# EAGLE board PX4FMUlite_V5 (EAGLE 6.5.0)
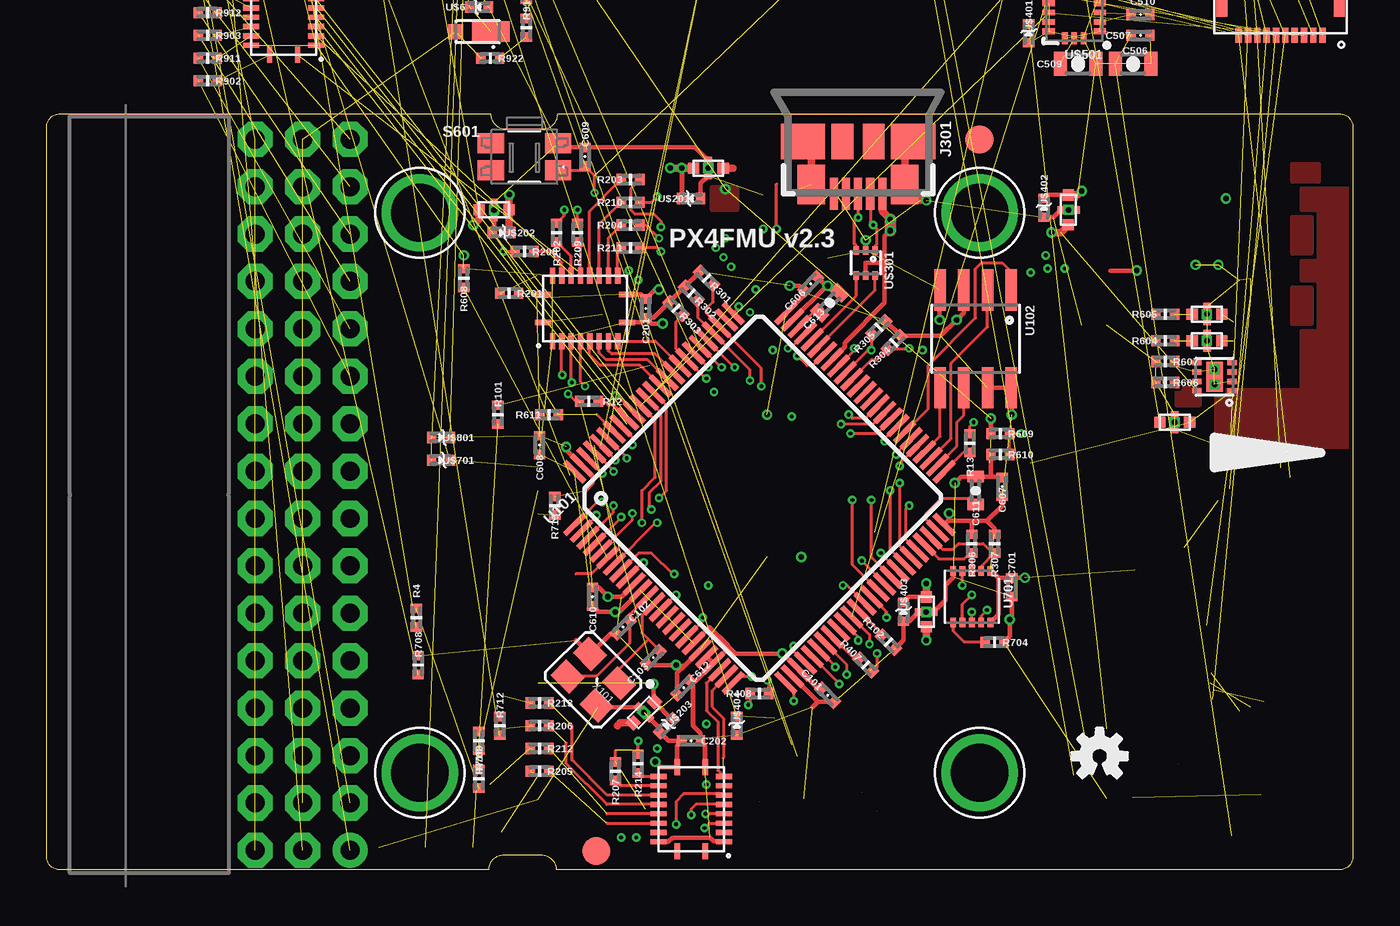
[diagram p12: board, top side]
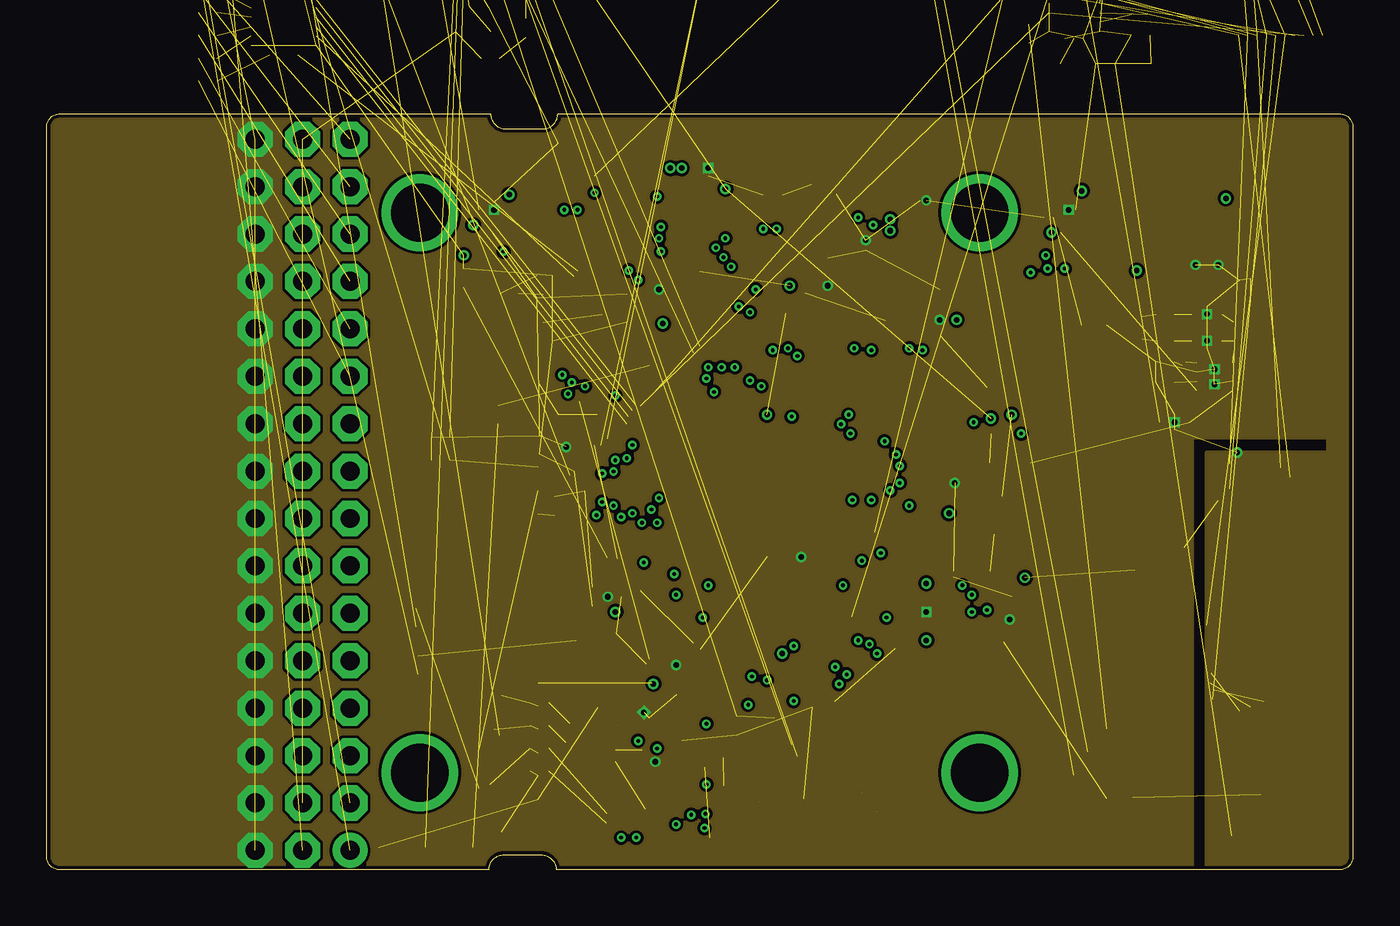
[diagram p13: board, inner layer Ground]
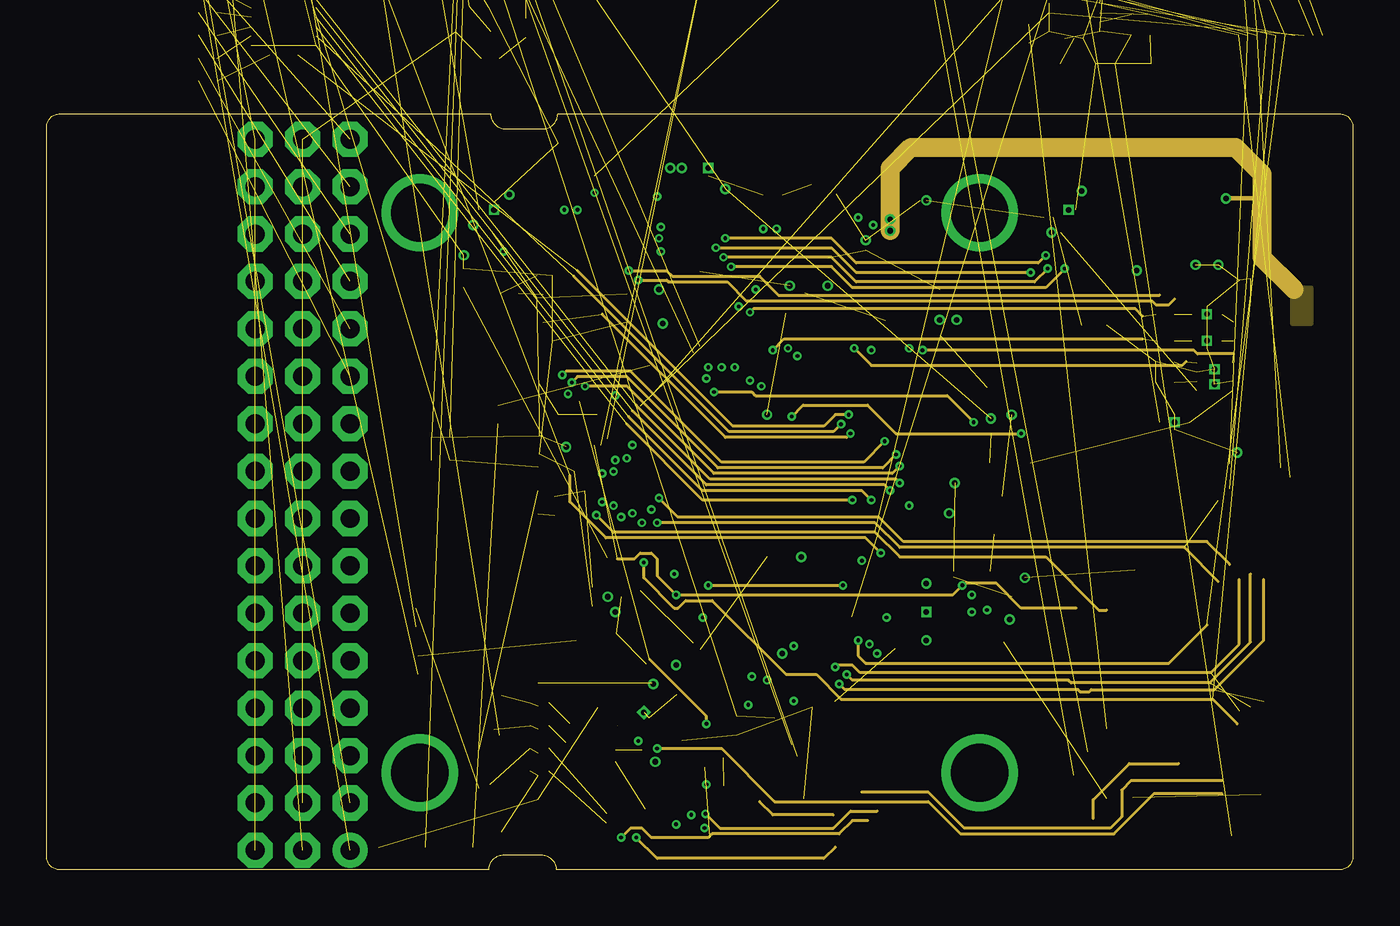
[diagram p14: board, inner layer Horizontal]
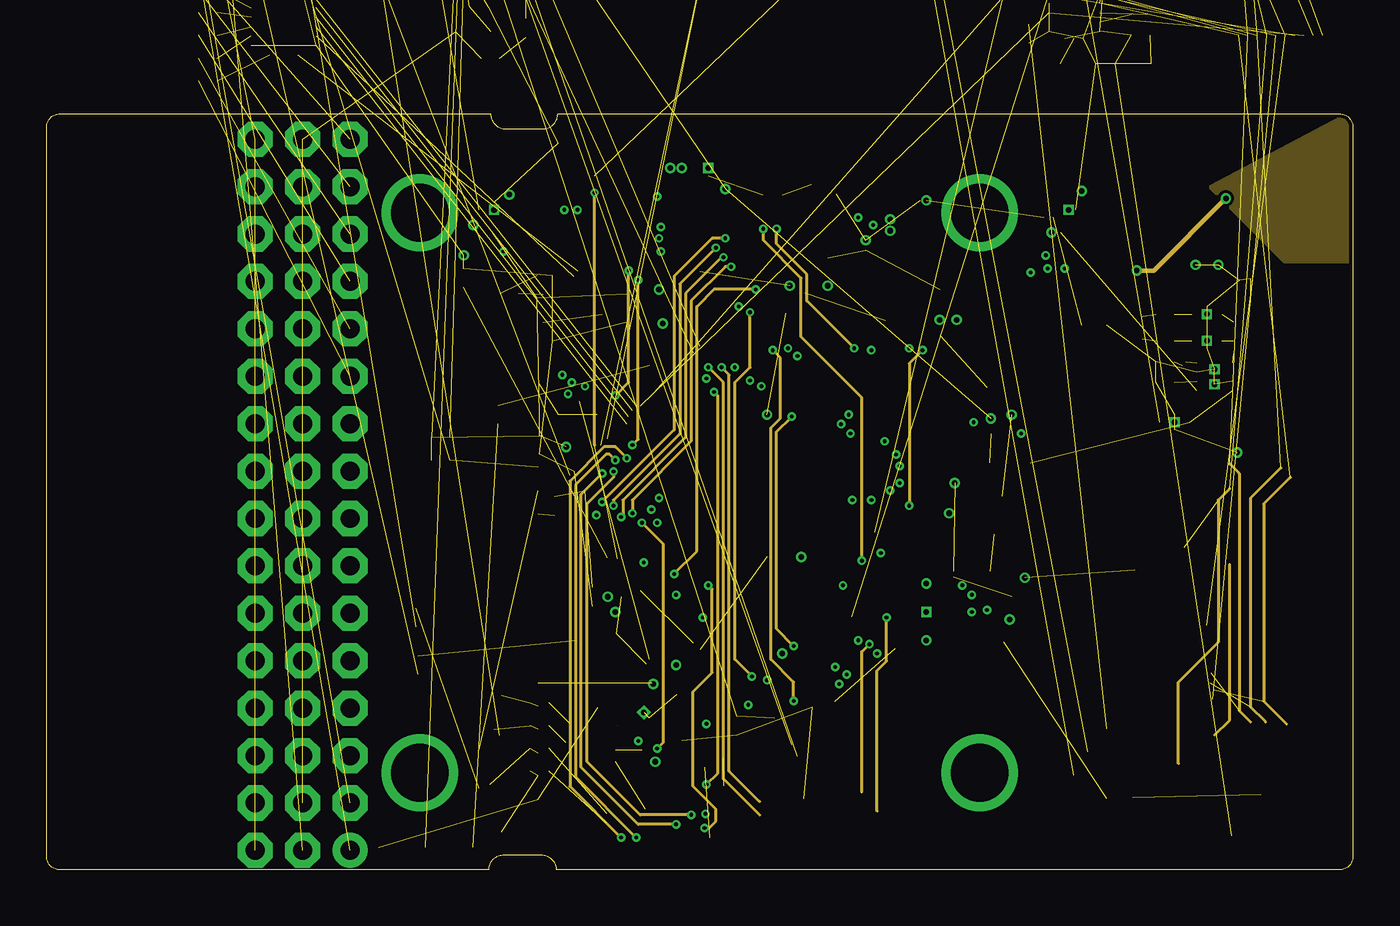
[diagram p15: board, inner layer Vertical]
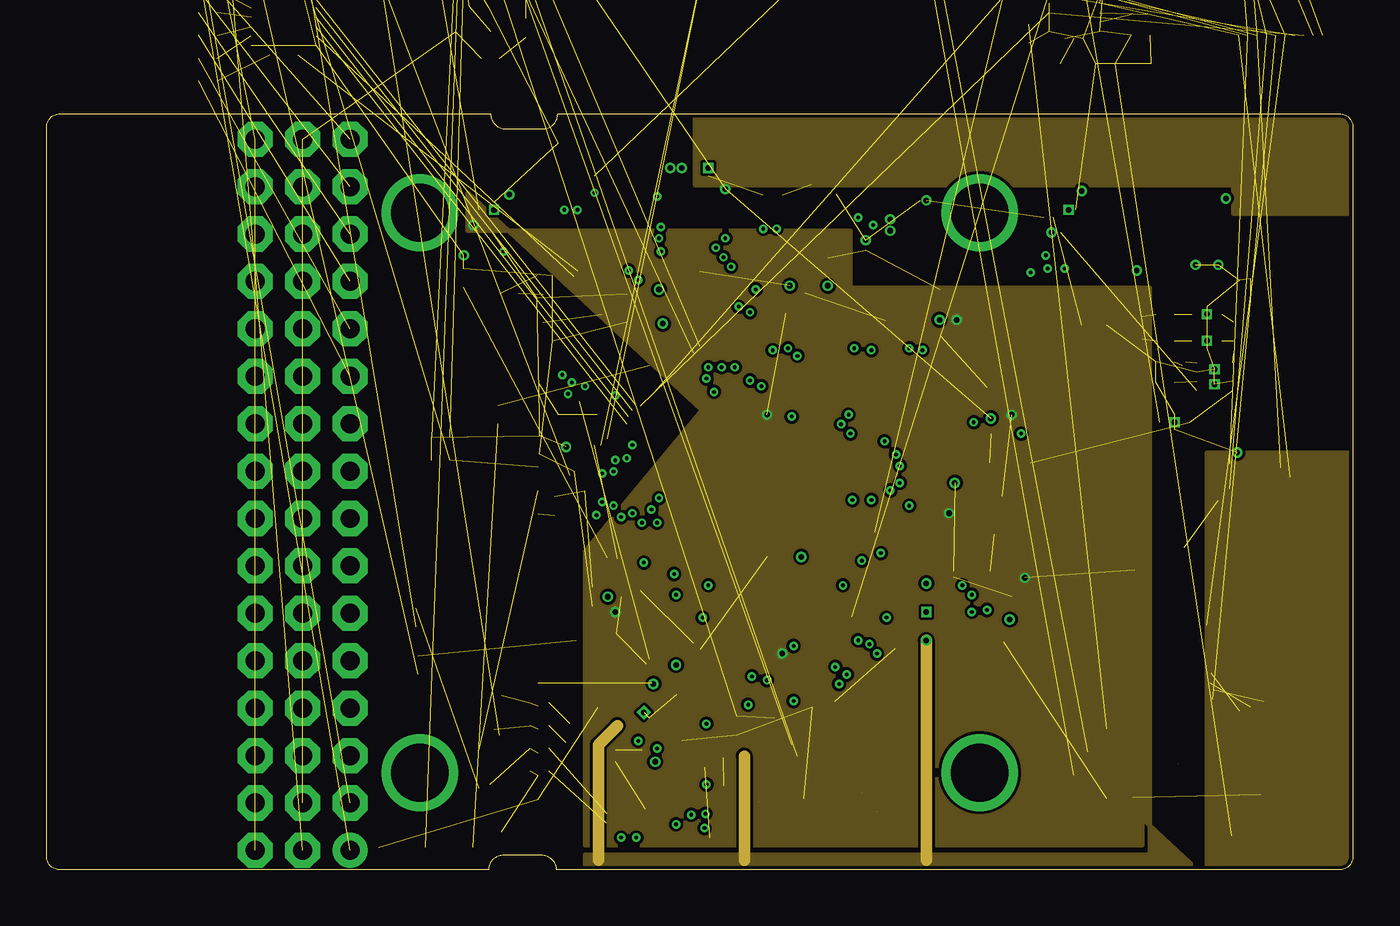
[diagram p16: board, inner layer Power]
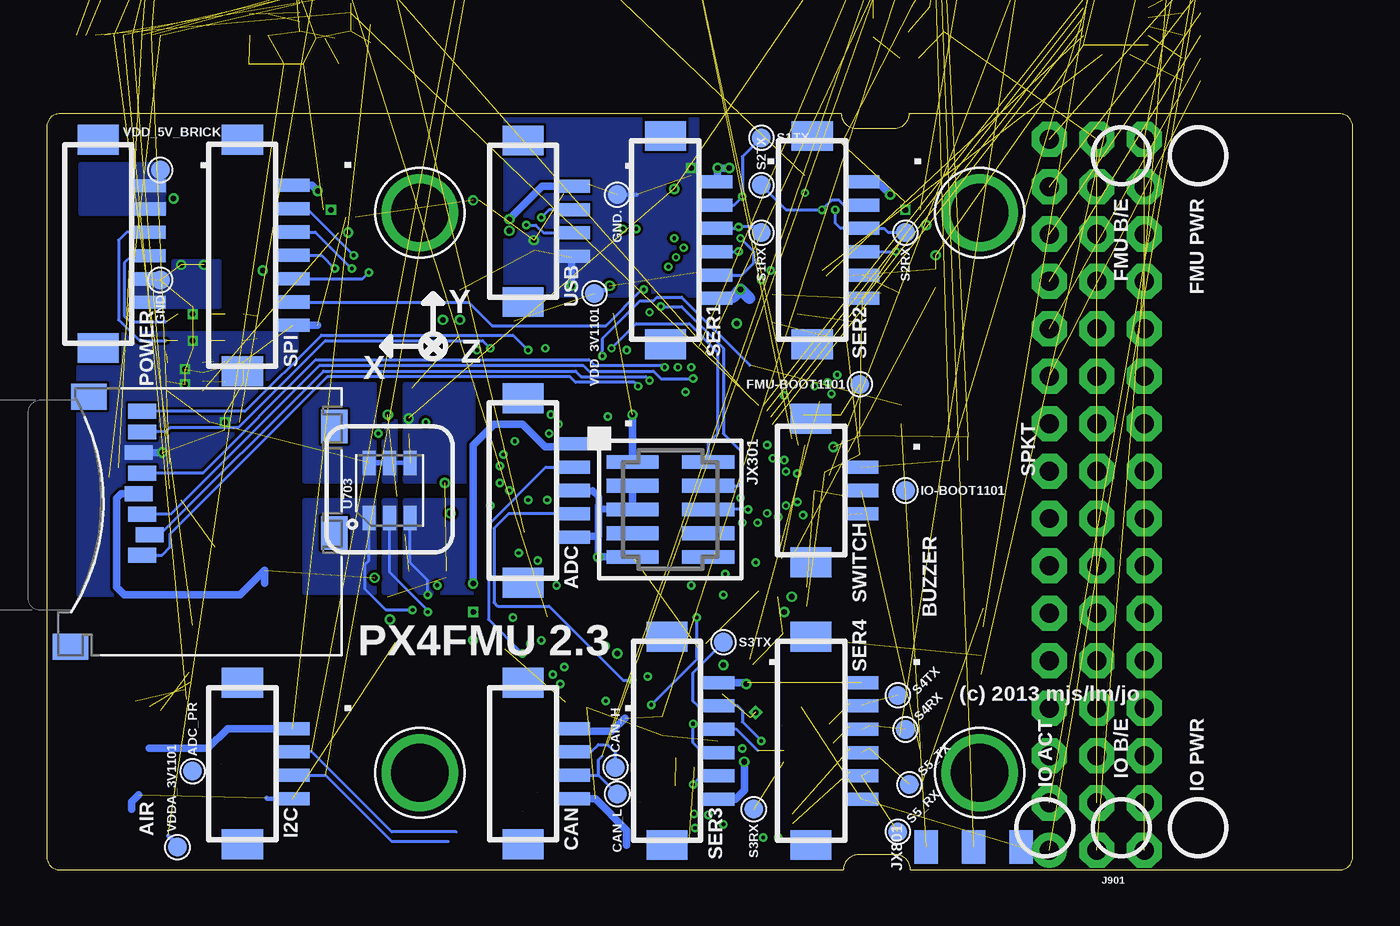
[diagram p17: board, bottom side, seen from below]

Size 70 x 40.5 mm. Coordinates in mm from the lower left corner, seen from the top.
Outline: 23.7,0 0.7,0 arc-90 0,0.7 0,39.8 arc-90 0.7,40.5 23.8,40.5 arc90 24.59,39.7 26.59,39.7 arc90 27.39,40.5 69.3,40.5 arc-90 70,39.8 70,0.7 arc-90 69.3,0 27.3,0 arc90 26.5,0.8 24.5,0.8 arc90 23.7,0
Copper layers (1*2*3*14*15*16): Top 0.035mm / dielectric 0.5mm / Ground 0.035mm / dielectric 0.15mm / Horizontal 0.035mm / dielectric 0.15mm / Vertical 0.035mm / dielectric 0.15mm / Power 0.035mm / dielectric 0.5mm / Bottom 0.035mm
Design rules "default *": minimum track width 0.15mm, minimum drill 0.2mm, track to track 0.15mm, track to pad 0.15mm, pad to pad 0.15mm, via to via 0.15mm, smd to smd 0.15mm, copper to edge 0.2mm, drill to drill 0.2mm, minimum pad ring 0.125mm, minimum via ring 0.125mm, stop-mask expansion 1mil, vias tented up to drill 0.31mm, thermal gap 8mil
Net classes: 0 signal: width 0.152 mm, drill 0.2 mm, clearance 0.152 mm; 1 power: width 0.254 mm, drill 0.3 mm, clearance 0.152 mm

## Footprints (pad centres in the part's own frame; a part is rotated, then mirrored left to right if it is on the bottom)
PAD.04X.04 = smd 1.016 x 1.016: P$1 0,0
0402-CAP = smd 0.5 x 0.6: P$1 -0.5,0; P$2 0.5,0
0805-CAP = smd 0.7 x 1.3: P$1 -0.95,0; P$2 0.95,0
0603-CAP = smd 0.6 x 0.9: P$1 -0.75,0; P$2 0.75,0
MICROSMP = smd 0.8 x 0.8: ANODE 0.65,0 | smd 2 x 1.1: CATHODE -1.25,0
SOT23-3 = smd 0.8 x 0.9: 1 -0.95,-1; 2 0.95,-1; 3 0,1.1
PTC-1206 = smd 1 x 1.8: 1 -1.4,0; 2 1.4,0
DF13C-6P-1.25V = smd 1.6 x 2.2: M$0 5.575,-1.8; M$1 -5.575,-1.8 | smd 0.7 x 1.8: P$1 -3.125,0.9; P$2 -1.875,0.9; P$3 -0.625,0.9; P$4 0.625,0.9; P$5 1.875,0.9; P$6 3.125,0.9
MOLEX-47346-0001 = smd 1.7 x 0.44: D+ 2.8,0; D- 2.8,0.65; GND 2.8,-1.3; ID 2.8,-0.65; VBUS 2.8,1.3 | smd 1.9 x 2.375: GND1 0,2.95; GND4 0,-2.95 | smd 2.1 x 1.475: GND2 2.3,2.5; GND3 2.3,-2.5 | smd 1.9 x 1.175: GND5 0,-0.838; GND6 0,0.838
DF13C-4P-1.25V = smd 1.6 x 2.2: M$0 4.325,-1.8; M$1 -4.325,-1.8 | smd 0.7 x 1.8: P$1 -1.875,0.9; P$2 -0.625,0.9; P$3 0.625,0.9; P$4 1.875,0.9
DF13C-7P-1.25V = smd 1.6 x 2.2: M$0 6.2,-1.8; M$1 -6.2,-1.8 | smd 0.7 x 1.8: P$1 -3.75,0.9; P$2 -2.5,0.9; P$3 -1.25,0.9; P$4 0,0.9; P$5 1.25,0.9; P$6 2.5,0.9; P$7 3.75,0.9
DF13C-5P-1.25V = smd 1.6 x 2.2: M$0 4.95,-1.8; M$1 -4.95,-1.8 | smd 0.7 x 1.8: P$1 -2.5,0.9; P$2 -1.25,0.9; P$3 0,0.9; P$4 1.25,0.9; P$5 2.5,0.9
DF13C-3P-1.25V = smd 1.6 x 2.2: M$0 3.85,-1.8; M$1 -3.85,-1.8 | smd 0.7 x 1.8: P$1 -1.25,0.9; P$2 0,0.9; P$3 1.25,0.9
JST-ZH-SMT-VERTICAL = smd 0.7 x 3.2: P$1 -1.5,-1.75; P$2 0,-1.75; P$3 1.5,-1.75 | smd 1.5 x 2.3: P$4 3.55,0.1; P$5 -3.55,0.1
3X16RA = drill 1.016 pad 1.88: 1 2.54,19.05 | drill 1.016 pad 1.88 octagon: 2 0,19.05; 3 -2.54,19.05; 4 2.54,16.51; 5 0,16.51; 6 -2.54,16.51; 7 2.54,13.97; 8 0,13.97; 9 -2.54,13.97; 10 2.54,11.43; 11 0,11.43; 12 -2.54,11.43; 13 2.54,8.89; 14 0,8.89; 15 -2.54,8.89; 16 2.54,6.35; 17 0,6.35; 18 -2.54,6.35; 19 2.54,3.81; 20 0,3.81; 21 -2.54,3.81; 22 2.54,1.27; 23 0,1.27; 24 -2.54,1.27; 25 2.54,-1.27; 26 0,-1.27; 27 -2.54,-1.27; 28 2.54,-3.81; 29 0,-3.81; 30 -2.54,-3.81; 31 2.54,-6.35; 32 0,-6.35; 33 -2.54,-6.35; 34 2.54,-8.89; 35 0,-8.89; 36 -2.54,-8.89; 37 2.54,-11.43; 38 0,-11.43; 39 -2.54,-11.43; 40 2.54,-13.97; 41 0,-13.97; 42 -2.54,-13.97; 43 2.54,-16.51; 44 0,-16.51; 45 -2.54,-16.51; 46 2.54,-19.05; 47 0,-19.05; 48 -2.54,-19.05
FIDUCIAL-1.5X3 = smd 1.5 x 1.5: 1 0,0
FTSH-105-01-XXX-DV-K = smd 0.737 x 2.794: 1 -2.54,-2.032; 2 -2.54,2.032; 3 -1.27,-2.032; 4 -1.27,2.032; 5 0,-2.032; 6 0,2.032; 7 1.27,-2.032; 8 1.27,2.032; 9 2.54,-2.032; 10 2.54,2.032
HEADER_3X01_SMD_H_BOARD_EDGE_SHORT = smd 1.27 x 1.778: 1 -2.54,0; 2 0,0; 3 2.54,0
KYOCERA-KNH16-DA = smd 0.6 x 0.6: P$1 -0.8,0; P$2 0.8,0 | smd 0.4 x 0.4: P$3 0,-0.4; P$4 0,0.4 | drill 0.3 pad 0.4 square: P$5 0,0
0603-LED = smd 0.6 x 0.9: A 0.75,0; C -0.75,0
MOUNT-HOLE3.1 = drill 3.1 pad 4.1: P$1 0,0
0402-RES = smd 0.5 x 0.6: P$1 -0.5,0; P$2 0.5,0
EVQP7J01K = smd 1.4 x 1.05: A1 -1.8,0.725; A2 1.8,0.725; B3 -1.8,-0.725; B4 1.8,-0.725
TQFP100 = smd 1.5 x 0.29: 1 -8,6; 2 -8,5.5; 3 -8,5; 4 -8,4.5; 5 -8,4; 6 -8,3.5; 7 -8,3; 8 -8,2.5; 9 -8,2; 10 -8,1.5; 11 -8,1; 12 -8,0.5; 13 -8,0; 14 -8,-0.5; 15 -8,-1; 16 -8,-1.5; 17 -8,-2; 18 -8,-2.5; 19 -8,-3; 20 -8,-3.5; 21 -8,-4; 22 -8,-4.5; 23 -8,-5; 24 -8,-5.5; 25 -8,-6; 51 8,-6; 52 8,-5.5; 53 8,-5; 54 8,-4.5; 55 8,-4; 56 8,-3.5; 57 8,-3; 58 8,-2.5; 59 8,-2; 60 8,-1.5; 61 8,-1; 62 8,-0.5; 63 8,0; 64 8,0.5; 65 8,1; 66 8,1.5; 67 8,2; 68 8,2.5; 69 8,3; 70 8,3.5; 71 8,4; 72 8,4.5; 73 8,5; 74 8,5.5; 75 8,6 | smd 0.29 x 1.5: 26 -6,-8; 27 -5.5,-8; 28 -5,-8; 29 -4.5,-8; 30 -4,-8; 31 -3.5,-8; 32 -3,-8; 33 -2.5,-8; 34 -2,-8; 35 -1.5,-8; 36 -1,-8; 37 -0.5,-8; 38 0,-8; 39 0.5,-8; 40 1,-8; 41 1.5,-8; 42 2,-8; 43 2.5,-8; 44 3,-8; 45 3.5,-8; 46 4,-8; 47 4.5,-8; 48 5,-8; 49 5.5,-8; 50 6,-8; 76 6,8; 77 5.5,8; 78 5,8; 79 4.5,8; 80 4,8; 81 3.5,8; 82 3,8; 83 2.5,8; 84 2,8; 85 1.5,8; 86 1,8; 87 0.5,8; 88 0,8; 89 -0.5,8; 90 -1,8; 91 -1.5,8; 92 -2,8; 93 -2.5,8; 94 -3,8; 95 -3.5,8; 96 -4,8; 97 -4.5,8; 98 -5,8; 99 -5.5,8; 100 -6,8
SO08 = smd 0.61 x 2.21: 1 -1.905,-2.616; 2 -0.635,-2.616; 3 0.635,-2.616; 4 1.905,-2.616; 5 1.905,2.616; 6 0.635,2.616; 7 -0.635,2.616; 8 -1.905,2.616
QFN20-RGY = smd 0.28 x 0.85: 1 -0.75,2.25; 10 -0.75,-2.25; 11 0.75,-2.25; 20 0.75,2.25 | smd 0.85 x 0.28: 2 -1.75,1.75; 3 -1.75,1.25; 4 -1.75,0.75; 5 -1.75,0.25; 6 -1.75,-0.25; 7 -1.75,-0.75; 8 -1.75,-1.25; 9 -1.75,-1.75; 12 1.75,-1.75; 13 1.75,-1.25; 14 1.75,-0.75; 15 1.75,-0.25; 16 1.75,0.25; 17 1.75,0.75; 18 1.75,1.25; 19 1.75,1.75
MICROSD = smd 0.8 x 1.5: 1 -1.94,2.7; 2 -0.84,2.3; 3 0.26,2.7; 4 1.36,2.9; 5 2.46,2.7; 6 3.56,2.9; 7 4.66,2.7; 8 5.76,2.7 | smd 1.4 x 1.9: NC -6.85,6.55; NC3 6.55,5.55 | smd 1.8 x 1.4: NC1 -0.75,-7.6; NC2 4.95,-7.6
SOT23-8 = smd 0.42 x 1.3: 1 -0.975,-1.175; 2 -0.325,-1.175; 3 0.325,-1.175; 4 0.975,-1.175; 5 0.975,1.175; 6 0.325,1.175; 7 -0.325,1.175; 8 -0.975,1.175
LGA-16L = smd 0.65 x 0.3: 1 -1.37,1; 2 -1.37,0.5; 3 -1.37,0; 4 -1.37,-0.5; 5 -1.37,-1; 9 1.37,-1; 10 1.37,-0.5; 11 1.37,0; 12 1.37,0.5; 13 1.37,1 | smd 0.3 x 0.65: 6 -0.5,-1.37; 7 0,-1.37; 8 0.5,-1.37; 14 0.5,1.37; 15 0,1.37; 16 -0.5,1.37
MS5611-01BA = smd 1.1 x 0.6: 1 -1.1,1.875; 2 -1.1,0.625; 3 -1.1,-0.625; 4 -1.1,-1.875; 5 1.1,-1.875; 6 1.1,-0.625; 7 1.1,0.625; 8 1.1,1.875
SON10 = smd 0.32 x 0.5: 1 -1,-1.375; 2 -0.5,-1.375; 3 0,-1.375; 4 0.5,-1.375; 5 1,-1.375; 6 1,1.375; 7 0.5,1.375; 8 0,1.375; 9 -0.5,1.375; 10 -1,1.375
6-PLCC = smd 1.3 x 0.7: A1 1.475,1.1; A2 1.475,0; A3 1.475,-1.1; C1 -1.475,1.1; C2 -1.475,0; C3 -1.475,-1.1
TSSOP8_SOT505-2 = smd 0.35 x 0.85: 1 -0.975,-1.775; 2 -0.325,-1.775; 3 0.325,-1.775; 4 0.975,-1.775; 5 0.975,1.775; 6 0.325,1.775; 7 -0.325,1.775; 8 -0.975,1.775
51281-1094 = smd 0.34 x 0.8: 1 0,0; 2 0.5,0; 3 1,0; 4 1.5,0; 5 2,0; 6 2.5,0; 7 3,0; 8 3.5,0; 9 4,0; 10 4.5,0 | smd 0.6 x 2.6: P$11 -0.9,-2.3; P$12 5.4,-2.3
0402-TVS = smd 0.5 x 0.6: A 0.5,0; C -0.5,0
SOT563-6 = smd 0.3 x 0.45: 1 -0.5,-0.675; 2 0,-0.675; 3 0.5,-0.675; 4 0.5,0.675; 5 0,0.675; 6 -0.5,0.675
QFN8-DSG = smd 0.28 x 0.5: 1 -0.75,-0.95; 2 -0.25,-0.95; 3 0.25,-0.95; 4 0.75,-0.95; 5 0.75,0.95; 6 0.25,0.95; 7 -0.25,0.95; 8 -0.75,0.95 | smd 1.6 x 0.9: GND 0,0 | drill 0.3 square: P$2 -0.4,0; P$3 0.4,0
MLF-8-EPAD = smd 0.5 x 0.3: 1 -0.8,0.75; 2 -0.8,0.25; 3 -0.8,-0.25; 4 -0.8,-0.75; 5 0.8,-0.75; 6 0.8,-0.25; 7 0.8,0.25; 8 0.8,0.75 | smd 0.7 x 1.4: GND 0,0
OSCILLATOR-3.2X2.5 = smd 1.4 x 1.2: 1 -1.1,-0.85; 2 1.1,-0.85; 3 1.1,0.85; 4 -1.1,0.85

## Placement (x,y rotation side)
ADC_PR  PAD.04  [PAD.04X.04]  62.18,5.28 270 bottom
C101  0u1  [0402-CAP]  41.86,9.35 315 top
C102  8p  [0402-CAP]  30.89,13 225 top
C103  8p  [0402-CAP]  32.51,11.38 45 top
C201  0u1  [0402-CAP]  32.11,30.07 90 top
C202  0u1  [0402-CAP]  34.54,6.91 180 top
C402  0u1  [0402-CAP]  20.02,59.94 180 top  (outside the outline)
C503  0u1  [0402-CAP]  67.77,53.54 0 top  (outside the outline)
C505  10n  [0402-CAP]  67.77,52.32 0 top  (outside the outline)
C506  10u/10V  [0805-CAP]  58.22,43.18 0 top
C507  0u1  [0402-CAP]  58.62,44.7 0 top  (outside the outline)
C508  0u1  [0402-CAP]  67.46,58.93 0 top  (outside the outline)
C509  10u/10V  [0805-CAP]  55.27,43.18 0 top
C510  0u47  [0402-CAP]  58.62,45.82 0 top  (outside the outline)
C601  2u2  [0603-CAP]  53.64,61.77 0 top  (outside the outline)
C602  10n  [0402-CAP]  55.07,57.51 90 top  (outside the outline)
C603  1u0  [0603-CAP]  57.4,59.44 0 top  (outside the outline)
C604  10u/10V  [0805-CAP]  57.2,57.61 0 top  (outside the outline)
C605  1u0  [0603-CAP]  57.4,60.96 0 top  (outside the outline)
C606  0u1  [0402-CAP]  40.94,31.39 45 top
C607  0u1  [0402-CAP]  51.21,20.52 90 top
C608  0u1  [0402-CAP]  26.42,22.76 90 top
C609  0u1  [0402-CAP]  28.85,38.2 270 top
C610  0u1  [0402-CAP]  29.26,14.63 90 top
C611  2u2  [0603-CAP]  49.78,20.32 90 top
C612  0u1  [0402-CAP]  34.14,9.75 225 top
C613  2u2  [0603-CAP]  41.96,30.38 45 top
C701  0u1  [0402-CAP]  51.71,15.14 270 top
C901  0u1  [0402-CAP]  11.48,57.81 0 top  (outside the outline)
C902  0u1  [0402-CAP]  12.7,49.48 180 top  (outside the outline)
C1001  1u0  [0603-CAP]  14.22,61.06 0 top  (outside the outline)
C1002  10n  [0402-CAP]  12.29,64.82 90 top  (outside the outline)
C1003  1u0  [0603-CAP]  9.35,62.89 270 top  (outside the outline)
C1004  1u0  [0603-CAP]  10.87,64.82 90 top  (outside the outline)
CAN_H  PAD.04  [PAD.04X.04]  39.52,5.49 90 bottom
CAN_L  PAD.04  [PAD.04X.04]  39.42,4.06 270 bottom
D1  MSS1P4-M3  [MICROSMP]  22.56,44.91 180 top  (outside the outline)
D1001  PMEG2005CT  [SOT23-3]  7.72,61.06 270 top  (outside the outline)
F2  0ZCA0035FF2G  [PTC-1206]  26.31,49.17 180 top  (outside the outline)
FMU-BOOT1101  PAD.04  [PAD.04X.04]  26.42,26.01 0 bottom
GND  PAD.04  [PAD.04X.04]  63.91,31.6 270 bottom
GND.  PAD.04  [PAD.04X.04]  39.42,36.17 0 bottom
IO-BOOT1101  PAD.04  [PAD.04X.04]  23.98,20.32 0 bottom
J201  DF13C-6P-1.25V  [DF13C-6P-1.25V]  35.04,33.74 270 bottom
J202  DF13C-6P-1.25V  [DF13C-6P-1.25V]  27.17,33.74 270 bottom
J203  DF13C-6P-1.25V  [DF13C-6P-1.25V]  34.95,6.91 270 bottom
J204  DF13C-6P-1.25V  [DF13C-6P-1.25V]  27.23,6.91 270 bottom
J301  47346-0001  [MOLEX-47346-0001]  43.48,39.01 270 top
J302  DF13C-4P-1.25V  [DF13C-4P-1.25V]  42.67,34.75 270 bottom
J401  DF13C-4P-1.25V  [DF13C-4P-1.25V]  57.71,5.69 270 bottom
J403  DF13C-7P-1.25V  [DF13C-7P-1.25V]  57.71,32.92 270 bottom
J404  DF13C-5P-1.25V  [DF13C-5P-1.25V]  42.67,20.32 270 bottom
J405  DF13C-4P-1.25V  [DF13C-4P-1.25V]  42.67,5.69 270 bottom
J601  DF13C-6P-1.25V  [DF13C-6P-1.25V]  65.43,33.53 270 bottom
J702  DF13C-3P-1.25V  [DF13C-3P-1.25V]  27.23,20.32 270 bottom
J801  JST-ZH-3  [JST-ZH-SMT-VERTICAL]  24.79,72.44 90 bottom  (outside the outline)
J901  [3X16RA]  13.72,20.09 180 bottom
JP1  FIDUCIAL1.5X3  [FIDUCIAL-1.5X3]  49.99,39.12 0 top
JP2  FIDUCIAL1.5X3  [FIDUCIAL-1.5X3]  29.46,1.02 0 top
JX301  ARM_MINI_JTAG-SMT  [FTSH-105-01-XXX-DV-K]  36.58,19.3 270 bottom
JX801  HEADER-3X1BOARDEDGE-SHORT  [HEADER_3X01_SMD_H_BOARD_EDGE_SHORT]  20.32,1.22 0 bottom
L201  KNH16C104DA5TS  [KYOCERA-KNH16-DA]  35.46,37.59 180 top
L202  KNH16C104DA5TS  [KYOCERA-KNH16-DA]  23.98,35.36 0 top
L203  KNH16C104DA5TS  [KYOCERA-KNH16-DA]  32,8.43 45 top
L402  KNH16C104DA5TS  [KYOCERA-KNH16-DA]  54.76,35.36 90 top
L403  KNH16C104DA5TS  [KYOCERA-KNH16-DA]  17.98,66.04 90 top  (outside the outline)
L404  KNH16C104DA5TS  [KYOCERA-KNH16-DA]  47.14,13.82 90 top
L601  KNH16C104DA5TS  [KYOCERA-KNH16-DA]  62.18,28.35 180 top
L602  KNH16C104DA5TS  [KYOCERA-KNH16-DA]  62.18,29.77 180 top
L603  KNH16C104DA5TS  [KYOCERA-KNH16-DA]  60.45,23.98 180 top
L901  KNH16C104DA5TS  [KYOCERA-KNH16-DA]  23.27,47.35 0 top  (outside the outline)
LED701  AMBER  [0603-LED]  11.68,48.46 270 bottom  (outside the outline)
LED702  GREEN  [0603-LED]  6.2,71.22 90 bottom  (outside the outline)
LED703  AMBER  [0603-LED]  10.26,71.22 90 bottom  (outside the outline)
LED704  GREEN  [0603-LED]  7.62,48.46 270 bottom  (outside the outline)
LED705  BLUE  [0603-LED]  14.33,71.22 90 bottom  (outside the outline)
M3_MOUNT1101  MOUNT-HOLE3.1MM  [MOUNT-HOLE3.1]  20,35.2 0 top
M3_MOUNT1102  MOUNT-HOLE3.1MM  [MOUNT-HOLE3.1]  50,5.2 0 top
M3_MOUNT1103  MOUNT-HOLE3.1MM  [MOUNT-HOLE3.1]  50,35.2 0 top
M3_MOUNT1104  MOUNT-HOLE3.1MM  [MOUNT-HOLE3.1]  20,5.2 0 top
OSHW_LOGO  OSHW-LOGOS  [OSHW-LOGO-S]  56.43,6.09 0 top
R3  220R  [0402-RES]  14.73,49.48 180 top  (outside the outline)
R4  220R  [0402-RES]  19.81,13.51 270 top
R12  120R  [0402-RES]  29.06,25.1 180 top
R13  120R  [0402-RES]  49.48,22.86 90 top
R101  470R  [0402-RES]  24.18,24.38 270 top
R102  10K  [0402-RES]  45.11,12.19 315 top
R201  120R  [0402-RES]  24.79,30.89 180 top
R202  120R  [0402-RES]  27.33,34.14 90 top
R203  120R  [0402-RES]  31.29,36.98 0 top
R204  120R  [0402-RES]  31.29,34.54 0 top
R205  120R  [0402-RES]  26.42,5.28 180 top
R206  120R  [0402-RES]  26.42,7.72 180 top
R207  120R  [0402-RES]  30.48,5.28 90 top
R208  120R  [0402-RES]  25.6,33.12 180 top
R209  120R  [0402-RES]  28.45,34.14 90 top
R210  120R  [0402-RES]  31.29,35.76 0 top
R211  120R  [0402-RES]  31.29,33.32 0 top
R212  120R  [0402-RES]  26.42,6.5 180 top
R213  120R  [0402-RES]  26.42,8.94 180 top
R214  120R  [0402-RES]  31.7,5.69 90 top
R301  100K  [0402-RES]  35.36,31.7 135 top
R302  100K  [0402-RES]  34.54,30.89 135 top
R303  100K  [0402-RES]  33.73,30.07 135 top
R304  100K  [0402-RES]  45.42,28.24 45 top
R305  100K  [0402-RES]  44.6,29.06 45 top
R306  1K5  [0402-RES]  49.58,17.48 90 top
R307  1K5  [0402-RES]  50.8,17.48 90 top
R401  1K5  [0402-RES]  39.62,72.54 180 top  (outside the outline)
R402  1K5  [0402-RES]  39.62,71.42 180 top  (outside the outline)
R404  120R  [0402-RES]  42.37,74.17 0 top  (outside the outline)
R405  120R  [0402-RES]  42.37,73.05 0 top  (outside the outline)
R407  10K/0.1%  [0402-RES]  43.89,10.97 315 top
R408  10K/0.1%  [0402-RES]  38.2,9.45 0 top
R409  120R  [0402-RES]  19.81,65.74 0 top  (outside the outline)
R603  10K  [0402-RES]  53.95,57.51 270 top  (outside the outline)
R604  10K/0.1%  [0402-RES]  59.94,28.35 0 top
R605  10K/0.1%  [0402-RES]  59.94,29.77 0 top
R606  25K  [0402-RES]  59.94,26.11 180 top
R607  10K  [0402-RES]  59.94,27.23 180 top
R608  1K  [0402-RES]  22.35,31.7 90 top
R609  10K/0.1%  [0402-RES]  51.1,23.37 180 top
R610  10K/0.1%  [0402-RES]  51.1,22.25 180 top
R611  10K  [0402-RES]  26.92,24.38 0 top
R704  10K  [0402-RES]  50.8,12.19 180 top
R707  220R  [0402-RES]  16.76,49.48 180 top  (outside the outline)
R708  220R  [0402-RES]  19.91,10.97 270 top
R709  220R  [0402-RES]  23.16,4.88 270 top
R710  47R  [0402-RES]  23.16,6.91 90 top
R711  220R  [0402-RES]  8.64,49.48 180 top  (outside the outline)
R712  220R  [0402-RES]  24.28,7.72 270 top
R713  1K5  [0402-RES]  27.23,19.51 90 top
R901  10K  [0402-RES]  14.43,62.79 270 top  (outside the outline)
R902  220R  [0402-RES]  8.64,42.27 180 top
R903  220R  [0402-RES]  8.64,44.7 180 top  (outside the outline)
R904  220R  [0402-RES]  8.64,47.14 180 top  (outside the outline)
R909  220R  [0402-RES]  7.01,57.81 180 top  (outside the outline)
R910  220R  [0402-RES]  7.01,58.93 180 top  (outside the outline)
R911  220R  [0402-RES]  8.64,43.48 180 top
R912  220R  [0402-RES]  8.64,45.92 180 top  (outside the outline)
R913  220R  [0402-RES]  8.64,48.36 180 top  (outside the outline)
R918  10K/0.1%  [0402-RES]  25.7,45.11 270 top  (outside the outline)
R919  10K/0.1%  [0402-RES]  25.7,47.14 270 top  (outside the outline)
R922  10K/0.1%  [0402-RES]  23.77,43.48 180 top
R1001  100K  [0402-RES]  14.12,59.23 180 top  (outside the outline)
R1002  10K  [0402-RES]  13.31,62.79 90 top  (outside the outline)
S1RX  PAD.04  [PAD.04X.04]  31.7,34.14 270 bottom
S1TX  PAD.04  [PAD.04X.04]  31.7,39.22 0 bottom
S2RX  PAD.04  [PAD.04X.04]  23.98,34.14 270 bottom
S2TX  PAD.04  [PAD.04X.04]  31.7,36.68 90 bottom
S3RX  PAD.04  [PAD.04X.04]  32.11,3.25 270 bottom
S3TX  PAD.04  [PAD.04X.04]  33.73,12.19 0 bottom
S4RX  PAD.04  [PAD.04X.04]  23.98,7.52 45 bottom
S4TX  PAD.04  [PAD.04X.04]  24.38,9.35 45 bottom
S5_RX  PAD.04  [PAD.04X.04]  24.38,2.03 45 bottom
S5_TX  PAD.04  [PAD.04X.04]  23.77,4.57 45 bottom
S601  RESET  [EVQP7J01K]  25.6,38.2 180 top
U101  STM32F4X7VX  [TQFP100]  38.2,19.91 45 top
U102  FM25V01  [SO08]  49.78,28.45 180 top
U201  TXS0108QFN20  [QFN20-RGY]  28.85,30.07 90 top
U202  TXS0108QFN20  [QFN20-RGY]  34.54,3.25 180 top
U301  2908-05WB-MG  [MICROSD]  62.18,18.8 90 bottom
U401  MAX3051  [SOT23-8]  20.02,62.38 0 top  (outside the outline)
U502  L3GD20H  [LGA-16L]  64.11,52.73 270 top  (outside the outline)
U503  MS5611-01BA  [MS5611-01BA]  55.07,50.09 270 top  (outside the outline)
U701  TCA62724FMG  [SON10]  49.58,14.63 180 top
U703  LRTB GFTG-T7AW-1+V7A7-29+R5T9-49-L  [6-PLCC]  51.61,20.32 90 bottom
U901  TXS0108QFN20  [QFN20-RGY]  12.7,45.92 180 top  (outside the outline)
U903  74LVC2G240  [TSSOP8_SOT505-2]  9.45,55.47 270 top  (outside the outline)
U$1  0512811094  [51281-1094]  68.38,44.7 180 top  (outside the outline)
U$6  PESD0402-140  [0402-TVS]  23.16,46.23 0 top  (outside the outline)
U$201  PESD0402-140  [0402-TVS]  34.54,35.97 0 top
U$202  PESD0402-140  [0402-TVS]  24.38,34.14 180 top
U$203  PESD0402-140  [0402-TVS]  33.22,7.72 225 top
U$301  NUF2042XV6  [SOT563-6]  43.89,32.51 180 top
U$401  PESD0402-140  [0402-TVS]  52.63,44.81 270 top  (outside the outline)
U$402  PESD0402-140  [0402-TVS]  53.44,35.46 270 top
U$403  PESD0402-140  [0402-TVS]  45.92,13.82 270 top
U$404  PESD0402-140  [0402-TVS]  36.98,7.72 270 top
U$501  LSM303D  [LGA-16L]  55.07,45.92 180 top  (outside the outline)
U$604  BQ24315  [QFN8-DSG]  62.59,26.42 90 top
U$605  MIC5332  [MLF-8-EPAD]  53.64,59.84 0 top  (outside the outline)
U$701  PESD0402-140  [0402-TVS]  21.13,21.95 180 top
U$801  PESD0402-140  [0402-TVS]  21.13,23.16 180 top
U$901  PESD0402-140  [0402-TVS]  9.04,57.81 0 top  (outside the outline)
U$902  PESD0402-140  [0402-TVS]  9.04,58.93 0 top  (outside the outline)
U$1001  BQ24313  [QFN8-DSG]  11.48,59.44 270 top  (outside the outline)
U$1002  MIC5332  [MLF-8-EPAD]  11.48,62.28 90 top  (outside the outline)
VDD_3V1101  PAD.04  [PAD.04X.04]  40.64,30.89 0 bottom
VDD_5V_BRICK  PAD.04  [PAD.04X.04]  63.91,37.49 270 bottom
VDDA_3V1101  PAD.04  [PAD.04X.04]  62.99,1.22 0 bottom
X101  3.2x2.5 mm / 24 MHz / 15 ppm  [OSCILLATOR-3.2X2.5]  29.29,10.18 135 top

## Tracks (layer width: path | path; a pad name or v marks a point on that pad's centre or on a via)
!ACCEL_MAG_CS  (via drill 0.2)  (2 unrouted)
  Top 0.152: U101.9 31.92,16.46 v32,16.46
  Horizontal 0.152: v32,16.46 32,15.65 33.63,14.02 33.83,14.02 34.24,14.43 35.66,14.43 39.62,10.46 41.25,10.46 42.57,9.14 62.48,9.14 63.8,7.82
!BARO_CS  (via drill 0.2)  (2 unrouted)
  Top 0.152: v32.82,19.91 33.22,20.32 33.22,24.89 U101.88 | U101.88
  Horizontal 0.152: 63.4,16.36 62.18,17.58 45.92,17.58 44.6,18.9 33.83,18.9 v32.82,19.91
  Vertical 0.152: 62.59,7.21 63.4,8.03 63.4,16.36
!FMU-LED_AMBER  (via drill 0.2)  (1 unrouted)
  Top 0.152: U101.43 44.7,16.95 v44.7,16.97
  Horizontal 0.152: v44.7,16.97 43.89,17.78 29.97,17.78 28.04,19.71 28.04,21.13
!FRAM_CS
  Top 0.152: U101.57 47.24,24.71 47.24,27.03 49.78,29.57 49.78,32.21 50.09,32.51 51.21,32.51 51.69,32.03 U102.1
!GYRO_CS  (via drill 0.2)  (4 unrouted)
  Top 0.152: U101.7 32.64,18.59 v32.72,18.59
  Horizontal 0.152: v32.72,18.59 44.4,18.59 45.72,17.27 60.96,17.27 62.79,15.44 | 56.08,2.74 56.08,3.76 58.01,5.69 60.66,5.69
  Vertical 0.152: 63.4,20.42 62.79,19.81 62.79,12.19 60.66,10.06 60.66,5.69
!SPI_EXT_NSS  (via drill 0.2)
  Top 0.152: U101.3 30.38,19.16 v30.38,19.51
  Horizontal 0.152: v35.87,33.33 42.06,33.33 43.38,32 v52.73,32
  Vertical 0.152: v35.87,33.33 33.93,31.39 33.93,23.37 30.38,19.81 v30.38,19.51
  Bottom 0.152: J403.P$5 53.07,31.67 v52.73,32
!VDD_5V_HIPOWER_OC  (via drill 0.2)
  Top 0.152: U101.41 v43.69,16.56 | v38.41,34.34 38.44,34.38
  Vertical 0.152: v43.69,16.56 43.69,25.3 40.44,28.55 40.44,31.7 38.41,33.73 v38.41,34.34
!VDD_5V_PERIPH_EN  (via drill 0.2)  (2 unrouted)
  Top 0.152: U101.67 43.28,27.82 v43.28,27.94 | v39.12,34.34 39.12,36.75
  Horizontal 0.152: 61.06,27.23 60.86,27.03 44.2,27.03 v43.28,27.94
  Vertical 0.152: v43.28,27.94 40.74,30.48 40.74,31.9 39.12,33.53 v39.12,34.34
!VDD_5V_PERIPH_OC  (via drill 0.2)  (1 unrouted)
  Top 0.152: v46.23,19.51 46.02,19.3 46.02,17.75 U101.46
  Horizontal 0.152: 63.6,27.64 61.67,27.64 61.47,27.84 v46.94,27.84
  Vertical 0.152: v46.94,27.84 46.23,27.13 v46.23,19.51
!VDD_BRICK_VALID  (via drill 0.2)
  Top 0.152: U101.91 30.59,25.4 v30.48,25.4
  Horizontal 0.152: v31.19,32.11 33.22,32.11 33.53,31.8 38.2,31.8 39.22,30.79 59.64,30.79
  Vertical 0.152: v30.48,25.4 31.19,26.11 v31.19,32.11
!VDD_SERVO_VALID  (via drill 0.2)
  Top 0.152: U101.93 31.39,23.18 v31.39,22.76
  Horizontal 0.152: v31.7,31.6 33.22,31.6 33.33,31.5 36.47,31.5 37.49,30.48 59.23,30.48 59.44,30.28 60.15,30.28 60.45,30.58
  Vertical 0.152: v31.39,22.76 31.7,23.06 v31.7,31.6
ACCEL_DRDY  (via drill 0.2)  (2 unrouted)
  Top 0.152: v31.9,18.59 31.9,20.32 32.61,21.03 32.61,24.08 U101.90
  Horizontal 0.152: 62.99,4.06 59.33,4.06 57.2,1.93 48.97,1.93 47.24,3.66 39.01,3.66 36.17,6.5 v32.72,6.5
  Vertical 0.152: v31.9,18.59 33.02,17.48 33.02,6.81 v32.72,6.5
BATT_CURRENT_SENS  (via drill 0.2)  (1 unrouted)
  Top 0.152: 40.03,9.6 v40.03,9.04
  Horizontal 0.152: v38.91,27.84 39.52,28.45 58.73,28.45
  Vertical 0.152: v40.03,9.04 40.03,10.06 38.81,11.28 38.81,23.67 39.32,24.18 39.32,27.43 v38.91,27.84
BATT_CURRENT_SENS_PROT  (1 unrouted)
  Bottom 0.152: J601.P$3 65.72,34.15 66.14,33.73 66.14,29.46 65.02,28.35 63.6,28.35
BATT_VOLTAGE_SENS  (via drill 0.2)  (1 unrouted)
  Top 0.152: 37.14,10.36 v37.8,10.36
  Horizontal 0.152: v37.69,29.87 37.9,30.07 58.32,30.07 58.73,29.67
  Vertical 0.152: v37.8,10.36 36.88,11.28 36.88,26.11 37.69,26.92 v37.69,29.87
BATT_VOLTAGE_SENS_PROT  (1 unrouted)
  Bottom 0.152: J601.P$4 65.45,32.9 65.84,32.51 65.84,29.67 65.53,29.36 63.6,29.36
CAN1_RX  (via drill 0.2)  (2 unrouted)
  Top 0.152: v36.17,26.92 36.14,26.92 U101.81
  Horizontal 0.152: 42.16,2.95 38.91,2.95 38.2,3.66
  Vertical 0.152: 38.2,3.66 36.58,5.28 36.58,26.52 v36.17,26.92
CAN1_TX  (via drill 0.2)  (1 unrouted)
  Top 0.152: v35.46,26.92 35.43,26.92 U101.82
  Vertical 0.152: v35.46,26.92 36.27,26.11 36.27,4.88 38.2,2.95
CAN2_RX
  Top 0.152: U101.51 49.13,22.36 R13.P$1
CAN2_TX
  Top 0.152: U101.92 30.39,24.89 30.07,24.89 29.87,25.09 R12.P$1
CAN_H  (2 unrouted)
  Bottom 0.152: CAN_H.P$1 39.52,6.3 39.93,6.71 40.44,6.71 40.83,6.32 J405.P$2
CAN_L  (2 unrouted)
  Bottom 0.152: J405.P$3 40.42,5.07 | 40.42,5.07 CAN_L.P$1 | 40.42,5.07 40.42,5.91 40.23,6.1
FMU-!RESET  (via drill 0.2)  (2 unrouted)
  Top 0.152: v49.07,15.24 49.07,16 U701.4 | v33.73,14.73 U101.14 | S601.A1 28.85,37.48 C609.P$2 29.36,37.19 v29.36,36.27
  Horizontal 0.152: 55.17,14.02 52.22,14.02 50.9,15.34 49.17,15.34 v49.07,15.24 48.56,14.73 v33.73,14.73 32.72,15.75 32.72,16.66 32.41,16.97 31.8,16.97 31.5,16.66 30.58,16.66
  Vertical 0.152: 29.36,22.76 v29.36,36.27
FMU-BOOT0  (2 unrouted)
  Top 0.152: U101.94 29.49,24.38
FMU-CH1  (via drill 0.2)  (1 unrouted)
  Top 0.152: v45.72,20.73 45.72,17.34 U101.45
  Horizontal 0.152: v45.72,20.73 45.52,20.93 35.56,20.93 31.6,24.89
FMU-CH1-PROT  (1 unrouted)
FMU-CH2  (via drill 0.2)  (1 unrouted)
  Top 0.152: U101.44 45.21,17.15 v45.21,20.32
  Horizontal 0.152: v45.21,20.32 44.91,20.62 35.36,20.62 31.39,24.59
FMU-CH3  (via drill 0.2)  (1 unrouted)
  Top 0.152: U101.42 44.2,16.75 v44.2,19.81
  Horizontal 0.152: v44.2,19.81 43.69,20.32 35.15,20.32 31.19,24.28
FMU-CH4  (via drill 0.2)  (1 unrouted)
  Top 0.152: U101.40 43.18,16.35 v43.18,19.81
  Horizontal 0.152: v43.18,19.81 35.15,19.81 31.09,23.88
FMU-CH5  (via drill 0.2)  (1 unrouted)
  Top 0.152: U101.60 44.28,23.88 v42.57,23.88
  Horizontal 0.152: v42.57,23.88 42.16,23.47 36.58,23.47 28.25,31.8
FMU-CH6  (via drill 0.2)  (1 unrouted)
  Top 0.152: U101.61 43.88,24.18 43.18,24.18 v42.98,24.38
  Horizontal 0.152: v42.98,24.38 42.27,24.38 41.66,23.77 36.78,23.77 28.45,32.11
FMU-CH6-PROT  (1 unrouted)
FMU-I2C1_SCL  (via drill 0.2)  (2 unrouted)
  Top 0.152: U101.95 31.09,22.08 v31.09,22.05
  Horizontal 0.152: 43.99,2.64 43.18,2.64 42.47,1.93 35.66,1.93 35.46,1.73 32.41,1.73 31.9,2.23 31.29,2.23 v30.79,1.73
  Vertical 0.152: v31.09,22.05 30.48,22.66 29.87,22.66 28.04,20.83 28.04,4.47 v30.79,1.73
FMU-I2C1_SDA  (via drill 0.2)  (2 unrouted)
  Top 0.152: U101.96 30.48,21.98 v30.48,21.95
  Horizontal 0.152: 42.27,1.22 41.66,0.61 32.72,0.61 v31.6,1.73
  Vertical 0.152: v30.48,21.95 30.18,22.25 29.97,22.25 28.35,20.62 28.35,4.98 v31.6,1.73
FMU-I2C2_SCL
  Top 0.152: U701.3 R306.P$1 49.49,16.98 49.17,16.66 47.82,16.66 U101.47
FMU-I2C2_SDA
  Top 0.152: U701.2 50.08,16.26 R307.P$1 50.69,16.98 50.19,17.48 48.87,17.48 48.56,17.17 48.02,17.17 U101.48
FMU-SWCLK  (via drill 0.2)
  Top 0.152: U101.76 37.08,30.11 v37.08,30.18
  Bottom 0.152: JX301.4 32.97,20.57 32.72,20.83 32.72,22.35 33.73,23.37 33.73,27.94 35.97,30.18 v37.08,30.18
FMU-SWDIO  (via drill 0.2)
  Top 0.152: v39.73,27.94 39.86,27.94 U101.72
  Bottom 0.152: v39.73,27.94 38.41,29.26 35.56,29.26 34.04,27.74 34.04,23.37 34.54,22.86 JX301.2
FMU-SWO  (via drill 0.2)
  Top 0.152: v32.41,19.3 32.31,19.41 32.31,20.22 32.92,20.83 32.92,24.49 U101.89
  Bottom 0.152: v32.41,19.3 JX301.6
FMU-UART4_RX  (1 unrouted)
  Top 0.152: U101.24 35.66,9.6 35.66,8.74 36.27,8.13 36.27,5.99
FMU-UART4_TX
  Top 0.152: U101.23 35.36,10 35.36,8.53 35.97,7.92 35.97,5.33 U202.9
FMU-UART7_RX  (via drill 0.2)
  Top 0.152: U202.4 35.52,2.5 v35.26,2.23 | U101.38 42.88,15.24 v42.67,15.24
  Horizontal 0.152: v35.46,15.24 v42.67,15.24
  Vertical 0.152: v35.26,2.23 35.5,2.23 35.87,2.6 35.87,3.25 34.65,4.47 34.65,9.55 35.66,10.57 35.66,15.04 v35.46,15.24
FMU-UART7_TX  (via drill 0.2)  (1 unrouted)
  Top 0.152: 44.19,14.63 U101.39 45.01,13.81 v45.01,13.51 | U202.5 v35.31,3
  Horizontal 0.152: v35.31,3 36.08,2.23 42.16,2.23 43.08,3.15 44.5,3.15
  Vertical 0.152: 44.5,3.15 44.5,10.67 45.01,11.18 v45.01,13.51
FMU-UART8_RX  (via drill 0.2)
  Top 0.152: U202.6 34.79,3.5 34.54,3.25 v34.54,2.95 | U101.97 30.38,21.37 v30.38,21.34
  Vertical 0.152: v34.54,2.95 31.8,2.95 28.96,5.79 28.96,19.61 30.38,21.03 v30.38,21.34
FMU-UART8_TX  (via drill 0.2)
  Top 0.152: U202.7 36.23,4.06 34.14,4.06 33.73,3.66 v33.73,2.44 | v29.77,21.23 29.77,21.27 U101.98
  Vertical 0.152: v33.73,2.44 31.7,2.44 28.65,5.49 28.65,20.12 v29.77,21.23
FMU-USART2_CTS
  Top 0.152: U201.9 32.62,28.32 U101.84
FMU-USART2_RTS
  Top 0.152: U101.85 32.6,27.64 30.28,27.64 30.1,27.81 U201.8
FMU-USART2_RX
  Top 0.152: U101.87 31.8,27.03 29.67,27.03 29.1,27.59 U201.6
FMU-USART2_TX
  Top 0.152: U101.86 32.2,27.33 29.97,27.33 29.6,27.7 U201.7
FMU-USART3_CTS  (via drill 0.2)
  Top 0.152: U101.58 44.91,23.08 v44.91,22.96 | v27.64,26.52 27.6,26.55 U201.3
  Horizontal 0.152: v44.91,22.96 43.79,21.84 36.17,21.84 31.29,26.72 27.84,26.72 v27.64,26.52
FMU-USART3_RTS  (via drill 0.2)  (1 unrouted)
  Top 0.152: U101.59 44.48,23.37 v43.08,23.37
  Horizontal 0.152: v43.08,23.37 42.88,23.16 36.37,23.16 29.77,29.77
FMU-USART3_RX  (via drill 0.2)
  Top 0.152: U101.56 45.52,22.28 v45.52,22.25 | v28.14,26.11 28.1,26.15 U201.4
  Horizontal 0.152: v45.52,22.25 44.81,21.54 35.97,21.54 31.09,26.42 28.45,26.42 v28.14,26.11
FMU-USART3_TX  (via drill 0.2)
  Top 0.152: U101.55 45.72,21.77 v45.72,21.64 | v28.85,25.91 28.6,26.16 U201.5
  Horizontal 0.152: v45.72,21.64 45.31,21.23 35.76,21.23 31.09,25.91 v28.85,25.91
FMU-VDD_3V3  (via drill 0.3)  (27 unrouted)
  Top 0.254: U101.11 30.69,13.82 v30.48,13.82 29.57,13.82 C610.P$1 | U101.22 34.76,10.11 C612.P$1 34.65,9.95 34.65,7.72 35.04,7.32 C202.P$1 35.29,6.66 U202.10 | C101.P$1 41.34,9.7 U101.28 39.46,11.58 v39.42,11.58 36.92,11.58 36.58,11.92 36.51,11.86 | U101.50 48.3,18.69 49.58,18.69 | 49.58,18.69 50.39,18.69 | v48.36,19.1 48.36,18.76 U101.50 | 48.15,18.5 U101.50 | C201.P$1 31.86,29.32 U201.10 | v51.71,24.38 51.71,25.81 U102.8 U102.7 | U102.3 49.15,29.84 v48.77,29.46 47.9,28.6 R304.P$2 R305.P$2 | C201.P$1 32.52,29.57 R303.P$2 R302.P$2 R301.P$2 | v33.02,29.26 32.42,29.26 C201.P$1 | R306.P$2 49.58,18.69 | R307.P$2 50.8,18.29 50.39,18.69 | U101.75 40.59,30.79 C606.P$1 40.34,31.29 v39.83,31.29 | U101.22 36.51,11.86 | U101.21 U101.22 | U101.19 35.53,13.01 36.51,12.03 36.51,11.86 | C607.P$1 51.21,19.51 50.39,18.69 | U701.10 51,13.68 51,15.65 | 51,15.65 50.64,16 U701.1 | 51,15.65 C701.P$1 52.42,15.64 v52.43,15.65 | U202.19 33.3,1.5 33.53,1.73 35.56,1.73 35.76,1.52 36.27,1.52 U202.2
  Bottom 0.254: VDD_3V1101.P$1 40.64,30.99 C606.P$1 40.08,31.04 v39.83,31.29
  Bottom 0.406: JX301.1 v38.61,24.38 | U301.4 66,20.16 66.24,19.91 66.24,15.14 65.84,14.73 59.64,14.73 58.32,16.05 58.32,15.34
  other vias: 22.35,32.92
  pour Power: 28.85,1.32 28.85,17.07 42.67,33.73 42.67,30.68 58.72,30.68 58.72,1.32
FMU-VDD_5V5  (4 unrouted)
FMU_AUX_ADC1  (via drill 0.2)
  Top 0.152: R408.P$1 37.7,8.95 v37.59,8.84 | v35.15,13.51 35.15,13.33 U101.18
  Bottom 0.152: v37.59,8.84 35.15,11.28 v35.15,13.51
FMU_AUX_ADC1_PROT  (via drill 0.2)
  Top 0.152: R408.P$2 38.7,10.07 v38.61,10.16
  Bottom 0.152: J404.P$4 45.24,19.07 46.02,18.29 46.02,14.33 45.82,14.12 43.08,14.12 39.12,10.16 v38.61,10.16
FMU_AUX_ADC2
  Top 0.152: U101.33 43.25,11.33 R407.P$1
FMU_AUX_ADC2_PROT  (via drill 0.2)
  Top 0.152: 44.3,10.57 R407.P$2 44.5,10.88 v44.5,11.58
  Bottom 0.152: v44.5,11.58 46.33,13.41 46.33,18.49 43.25,21.57 J404.P$2
FRAM_MISO
  Top 0.152: U101.53 48.46,23.1 48.46,27.13 50.42,29.08 U102.2
FRAM_MOSI
  Top 0.152: U101.54 47.88,23.23 U102.5
FRAM_SCK
  Top 0.152: U101.52 48.77,22.7 48.77,23.98 49.15,24.36 U102.6
GNDX  (via drill 0.3)  (134 unrouted)
  Top 0.254: U101.10 30.8,14.63 v30.07,14.63 29.57,15.13 C610.P$2 | C102.P$2 30.21,12.65 X101.2 28.38,12.29 | U101.20 34.17,10.94 | 34.17,10.94 33.78,10.55 C612.P$2 | 34.17,10.94 33.77,10.94 v33.73,10.97 32.21,10.97 C103.P$1 | U101.27 41.34,8.99 | 41.34,8.99 C101.P$2 | v32.61,5.79 32.9,5.5 U202.11 33.79,6.66 C202.P$2 33.33,6.91 U$203.A 32.87,7.57 L203.P$3 | 28.85,20.32 29.26,20.73 29.26,21.08 U101.99 27.84,22.5 v27.84,22.66 | U201.11 31.86,30.82 C201.P$2 32.62,31.09 v32.82,31.09 | U102.4 47.85,31.04 v47.85,29.46 | 40.98,38.56 J301.GND4 | 45.98,38.56 J301.GND1 | 42.3,36.21 J301.GND 41.48,36.21 J301.GND3 | R704.P$1 51.61,12.51 v51.61,13.41 51.71,13.51 C701.P$2 | U$202.A 23.98,34.23 L202.P$3 L202.P$5 L202.P$4 | C606.P$2 41.75,31.29 | 41.75,31.29 v41.86,31.29 42.11,31.29 C613.P$2 | 41.75,31.29 41.75,31.24 U101.74 | U$301.2 v43.89,33.73 | 41.05,8.7 41.34,8.99 | R102.P$2 45.92,12.3 U$403.A 46.24,13.32 L404.P$4 L404.P$5 L404.P$3 48.16,14.43 48.16,15.24 48.58,15.66 U701.5 | X101.4 29.55,8.72 L203.P$4 | L203.P$4 | L203.P$4 L203.P$5 | v48.67,20.73 49.01,21.07 C611.P$2 50.7,21.07 | 50.7,21.07 51.16,21.07 C607.P$2 | R610.P$2 50.6,21.16 50.7,21.07 | U$402.A 53.96,34.96 L402.P$4 L402.P$5 L402.P$3 | S601.B3 27.63,38.7 C609.P$1 34.75,38.7 L201.P$3 L201.P$5 L201.P$4 35.04,36.78 U$201.A
  Top 0.406: J301.GND3 40.98,38.56 | 45.98,38.56 J301.GND2 46.83,35.87 v47.14,35.87
  Bottom 0.254: J203.P$6 34.14,3.7 | J404.P$5 41.71,17.88 | J302.P$4 41.86,32.78 | 34.07,30.68 J201.P$6 | 55.48,29.17 55.47,29.16 | GND..P$1 38.4,36.17 | 58.22,3.86 58.17,3.81 J401.P$4
  Bottom 0.381: v40.44,16.76 40.44,17.88 | J404.P$3 40.74,20.32 40.44,20.02 40.44,19.51 | JX301.5 40.44,19.3
  Bottom 0.406: JX301.3 JX301.5 | 41.71,17.88 40.44,17.88 40.44,19.3 40.44,19.51 | v40.44,16.76 JX301.9 | 41.86,32.78 v41.86,31.29 | v63.8,22.35 v63.8,22.36 U301.6 | J405.P$4 40.59,3.81 38.91,2.13 38.91,1.32 | J203.P$6 33.1,3.78 32.61,4.27 v32.61,5.79 | 65.43,3.25 65.43,3.66 65.06,4.03 | J403.P$7 55.48,29.17
  Bottom 0.61: 34.07,30.68 33.22,30.68 v32.82,31.09 32.34,30.61
  other vias: 62.79,32.41 61.57,32.41
  pour Ground (no thermals): 69.9,40.54 0,40.54 0,0.02 arc90 0.02,0 61.37,0 61.37,23.16 68.68,23.16 68.68,22.35 62.18,22.35 62.18,0 69.9,0
  pour Bottom (no thermals): 65.33,30.18 60.76,30.18 60.76,32.61 63.2,32.61 63.2,31.9 65.33,31.9
  pour Bottom (no thermals): 56.59,14.73 56.59,28.75 68.28,28.75 68.28,14.73
  pour Bottom (no thermals): 35.15,30.78 35.15,40.34 45.42,40.34 45.42,30.78
GPIO_EXT_1  (via drill 0.2)
  Top 0.152: v33.63,15.85 33.53,15.85 32.41,16.97 31.72,16.97 U101.8
  Vertical 0.152: v33.63,15.85 34.85,17.07 34.85,30.18 35.76,31.09 v38,31.09
  Bottom 0.152: J403.P$6 47.39,30.42 46.13,29.16 40.03,29.16 38.1,31.09 v38,31.09
GYRO_DRDY  (via drill 0.2)  (2 unrouted)
  Top 0.152: v43.48,12.29 43.48,12.5 42.8,13.18 U101.35
  Horizontal 0.152: v43.48,12.29 43.48,11.48 43.89,11.07 60.15,11.07 62.18,13.11
IO-USART1_RX  (1 unrouted)
IO-USART1_TX  (1 unrouted)
IO-VDD_3V3  (5 unrouted)
IO-VDD_5V5  (7 unrouted)
MAG_DRDY  (via drill 0.2)  (3 unrouted)
  Top 0.152: U101.36 44.09,12.61 v44.09,12.09
  Horizontal 0.152: 62.99,4.78 58.12,4.78 57.61,4.27 57.61,2.85 57,2.23 49.17,2.23 47.24,4.17 43.69,4.17
  Vertical 0.152: 43.69,4.17 43.69,11.68 v44.09,12.09
N$1
  Top 0.152: U101.13 31.9,13.61 31.9,12.7 32.26,12.34 | 32.26,12.34 C103.P$2 | X101.1 30.67,10.76 32.26,12.34
N$2
  Top 0.152: U101.12 31.24,13.66 C102.P$1 31.24,12.14 29.46,10.36 27.92,10.36 X101.3
N$3  (1 unrouted)
N$4  (1 unrouted)
N$5  (via drill 0.3)
  Top 0.254: v34.04,37.59 U$201.C
  Top 0.406: L201.P$2 v34.04,37.59 v33.43,37.59
  Bottom 0.406: J201.P$1 34.04,36.97 v34.04,37.59 v33.43,37.59
N$6  (1 unrouted)
N$7  (1 unrouted)
N$8
  Top 0.152: U101.73 41.06,29.85 C613.P$1
N$9  (1 unrouted)
N$10  (1 unrouted)
N$11  (1 unrouted)
N$12
  Top 0.152: U101.49 47.14,18.75 47.14,19.1 47.95,19.91 49.44,19.91 C611.P$1
N$13  (1 unrouted)
N$14  (via drill 0.2)  (1 unrouted)
  Top 0.152: R12.P$2 28.35,25.09 v27.94,25.5
  Horizontal 0.152: v35.36,7.82 35.36,8.23 32.31,11.28
  Bottom 0.152: J203.P$4 34.83,6.28 35.36,6.81 v35.36,7.82
N$17  (1 unrouted)
N$19  (via drill 0.2)
  Top 0.152: R13.P$2 49.48,23.77 v49.68,23.98
  Horizontal 0.152: v35.76,25.6 37.8,25.6 38,25.4 48.26,25.4 v49.68,23.98
  Vertical 0.152: v35.36,4.57 35.97,5.18 35.97,25.4 v35.76,25.6
  Bottom 0.152: v35.36,4.57 34.9,5.03 J203.P$5
N$20  (1 unrouted)
N$23  (via drill 0.2)  (1 unrouted)
  Top 0.152: U101.69 41.07,27.03 40.74,27.03 v40.23,27.53
  Bottom 0.152: v40.23,27.53 40.23,28.45 38.2,30.48 37.49,30.48 37.29,30.68 35.97,30.68 32.31,27.03
N$26  (1 unrouted)
N$29  (1 unrouted)
N$30  (1 unrouted)
N$33  (1 unrouted)
  Bottom 0.152: 48.06,2.03 51.51,2.03 55.79,6.32 J401.P$2
N$34  (1 unrouted)
N$37  (1 unrouted)
  Bottom 0.152: J401.P$3 55.05,5.07 51.51,1.52 48.46,1.52
N$38  (3 unrouted)
N$39  (1 unrouted)
N$40  (1 unrouted)
N$41  (via drill 0.3)
  Top 0.254: U$402.C 53.64,36.16 L402.P$2
  Top 0.406: L402.P$2 55.26,36.16 v55.47,36.37
  Bottom 0.406: v55.47,36.37 55.77,36.67 J403.P$1
N$42  (1 unrouted)
  Bottom 0.406: 64.5,6.5 61.37,6.5 60.3,7.57 J401.P$1
N$46  (1 unrouted)
N$48  (2 unrouted)
  Bottom 0.254: J405.P$1 41.62,7.42
  Bottom 0.406: 39.01,8.13 39.73,7.42 41.62,7.42
N$57  (1 unrouted)
N$61  (1 unrouted)
N$62  (1 unrouted)
N$63  (1 unrouted)
N$64  (1 unrouted)
N$65  (1 unrouted)
N$66  (1 unrouted)
N$68  (1 unrouted)
N$70  (1 unrouted)
N$77  (1 unrouted)
N$78  (1 unrouted)
N$79  (1 unrouted)
N$82
  Top 0.152: U201.18 27.6,32.54 27.03,33.12 R208.P$1
N$83
  Top 0.152: U201.17 28.1,32.86 R202.P$1
N$84
  Top 0.152: U201.16 28.6,33.48 R209.P$1
N$85
  Top 0.152: U201.15 29.1,35.29 R203.P$1
N$86
  Top 0.152: U201.14 29.6,34.58 R210.P$1
N$87
  Top 0.152: U201.13 30.1,33.86 R204.P$1
N$88
  Top 0.152: U201.12 30.6,33.14 R211.P$1
N$89
  Top 0.152: U202.13 30.76,4.5 R207.P$1
N$90
  Top 0.152: R214.P$1 31.89,5 U202.12
N$91  (1 unrouted)
  Top 0.152: 30.01,2.5 U202.17
N$92  (1 unrouted)
  Top 0.152: U202.16 30.02,3
N$93  (1 unrouted)
  Top 0.152: U202.15 30.03,3.5 27.84,5.69 27.84,6.8
N$94  (1 unrouted)
  Top 0.152: U202.14 30.04,4 28.14,5.89 28.14,7.72 28.04,7.82
N$95
  Top 0.152: R704.P$2 49.17,12.19 48.77,12.6 48.58,12.79 U701.6
N$98  (via drill 0.3)
  Top 0.254: U$403.C 46.22,14.62 L404.P$2
  Top 0.406: L404.P$2 v47.14,15.34
  Bottom 0.406: v47.14,15.34 47.14,22.76 46.02,23.88 44.5,23.88 43.28,22.66 41.94,22.66 J404.P$1
N$99  (1 unrouted)
N$100  (via drill 0.3)  (1 unrouted)
  Top 0.254: U$203.C 33.49,8.07 L203.P$2 32.51,9.06 v32.51,9.96
  Bottom 0.254: 32.44,10.03 v32.51,9.96
  Bottom 0.406: v32.51,9.96 32.59,10.03 J203.P$1
N$101  (via drill 0.3)
  Top 0.254: U$202.C 24.78,34.24 | L202.P$2
  Top 0.406: 24.78,34.24 L202.P$2 | L202.P$2 v24.79,36.17
  Bottom 0.254: 26.15,36.98 J202.P$1
  Bottom 0.406: J202.P$1 25.48,36.86 v24.79,36.17
N$102  (1 unrouted)
N$103  (1 unrouted)
N$104  (1 unrouted)
N$110  (2 unrouted)
OTG_DM1  (via drill 0.2)
  Top 0.152: U$301.1 44.39,33.42 44.5,33.53 44.5,34.34 v44.3,34.54 | 44.39,34.45 v44.3,34.54 | J301.D- 44.13,34.71 v44.3,34.54
  Bottom 0.152: v44.3,34.54 43.79,34.54 43.37,34.12 J302.P$3
OTG_DP1  (via drill 0.2)
  Top 0.152: J301.D+ v43.48,34.95 | U$301.3 43.39,33.42 43.28,33.53 43.28,34.75 v43.48,34.95 | v43.48,34.95 43.39,34.86 v43.48,34.95
  Bottom 0.152: J302.P$2 43.06,35.37 v43.48,34.95
OTG_FS_DM
  Top 0.152: U101.70 44.39,31.05 U$301.6
OTG_FS_DP
  Top 0.152: U101.71 43.39,30.76 U$301.4
PB2-BOOT1
  Top 0.152: U101.37 44.76,12.65 R102.P$1
PPM-SBUS-PROT  (1 unrouted)
PPM_INPUT  (2 unrouted)
RGB_LED_3  (via drill 0.2)
  Top 0.152: U701.9 50.08,13.61 v50.39,13.92
  Bottom 0.152: v50.39,13.92 51.82,13.92 52.93,15.04 52.93,16.36 52.73,16.56 52.73,18.83 U703.C1
  pour Bottom (no thermals): 52.43,19.81 52.43,14.83 56.18,14.83 56.18,19.81
RGB_LED_4  (via drill 0.2)
  Top 0.152: U701.8 v49.58,13.82
  Bottom 0.152: v49.58,13.82 49.58,13.92 51.61,15.95 U703.C2
  pour Bottom (no thermals): 51.31,19.81 51.31,14.83 51.92,14.83 51.92,19.81
RGB_LED_14  (via drill 0.2)
  Top 0.152: U701.7 49.08,14.23 v49.58,14.73
  Bottom 0.152: U703.C3 50.51,16.44 49.58,15.51 v49.58,14.73
  pour Bottom (no thermals): 50.8,19.81 50.8,14.83 47.14,14.83 47.14,19.81
SAFETY  (1 unrouted)
SDIO_CK  (via drill 0.2)
  Top 0.152: v36.88,26.92 36.85,26.92 U101.80
  Bottom 0.152: v36.88,26.92 36.98,27.03 40.64,27.03 40.95,27.33 55.58,27.33 61.65,21.26 U301.5
SDIO_CMD  (via drill 0.2)
  Top 0.152: R303.P$1 33.73,29.37 33.73,27.92 U101.83 35.34,26.31 v35.36,26.31
  Bottom 0.152: v35.36,26.31 37.08,26.31 37.49,26.72 40.95,26.72 41.25,27.03 41.35,27.03 55.37,27.03 63.34,19.06 U301.3
SDIO_D0  (via drill 0.2)
  Top 0.152: U101.65 44.2,27.33 44.5,27.33 R304.P$1 46.18,27.89 v46.23,27.94
  Bottom 0.152: 59.74,23.67 55.07,28.35 46.63,28.35 v46.23,27.94 | 59.75,23.66 59.74,23.67 | 59.74,23.67 63.4,23.67 63.62,23.46 U301.7
SDIO_D1  (via drill 0.2)
  Top 0.152: U101.66 44.01,27.84 v44.2,27.84 44.2,28.65 R305.P$1
  Bottom 0.152: v44.2,27.84 45.01,28.65 55.27,28.65 59.37,24.56 U301.8
SDIO_D2  (via drill 0.2)
  Top 0.152: R301.P$1 35.71,30.43 35.36,30.07 35.36,29.83 U101.78 38.3,26.88 v38.3,25.91
  Bottom 0.152: v38.3,25.91 38.51,26.11 41.66,26.11 41.96,26.42 54.97,26.42 63.4,17.98 63.4,17.27 63.81,16.86 U301.1
SDIO_D3  (via drill 0.2)
  Top 0.152: R302.P$1 34.9,29.58 U101.79 37.69,26.79 v37.69,26.21
  Bottom 0.152: v37.69,26.21 37.9,26.42 41.35,26.42 41.66,26.72 55.17,26.72 63.93,17.96 U301.2
SERIAL1_CTS  (via drill 0.2)
  Top 0.152: v32.92,33.12 32.72,33.33 R211.P$2
  Bottom 0.152: J201.P$4 arc90 34.13,33.12 v32.92,33.12
SERIAL1_RTS  (via drill 0.2)
  Top 0.152: v32.82,33.83 32.11,34.54 R204.P$2
  Bottom 0.152: J201.P$5 32.76,31.86 32.11,32.51 32.11,33.12 v32.82,33.83
SERIAL1_RX  (via drill 0.2)
  Top 0.152: R203.P$2 31.29,36.48 31.29,35.36 31.5,35.15 32.51,35.15 32.92,34.75 v32.92,34.44
  Bottom 0.152: J201.P$3 33,34.36 v32.92,34.44 32,34.44 S1RX.P$1
SERIAL1_TX  (via drill 0.2)
  Top 0.152: R210.P$2 32.41,35.76 v32.72,36.07
  Bottom 0.152: J201.P$2 33.17,35.61 v32.72,36.07 32.72,38.2 S1TX.P$1
SERIAL2_CTS  (via drill 0.2)
  Top 0.152: R208.P$2 v24.49,33.12
  Bottom 0.152: J202.P$4 26.26,33.12 v24.49,33.12
SERIAL2_RTS  (1 unrouted)
SERIAL2_RX  (via drill 0.2)
  Top 0.152: R202.P$2 27.74,35.04 v27.74,35.36
  Bottom 0.152: S2RX.P$1 24.89,34.14 25.09,34.34 26.25,34.34 J202.P$3 27.45,34.36 27.74,34.65 v27.74,35.36
SERIAL2_TX  (via drill 0.2)
  Top 0.152: R209.P$2 v28.45,35.36
  Bottom 0.152: J202.P$2 27.28,35.61 27.53,35.87 27.94,35.87 v28.45,35.36 30.38,35.36 S2TX.P$1
SERIAL3_RX  (2 unrouted)
  Top 0.152: R207.P$2 30.48,6.4
  Bottom 0.152: 31.9,6.4 33.03,7.53 J203.P$3
SERIAL3_TX  (via drill 0.2)
  Top 0.152: R214.P$2 v31.7,6.91
  Bottom 0.152: S3TX.P$1 35.36,10.57 35.36,9.04 35.1,8.78 J203.P$2 32.97,8.78 32.72,8.53 32.72,7.92 v31.7,6.91
SERIAL4_RX  (2 unrouted)
SERIAL4_TX  (2 unrouted)
SERIAL5_RX  (2 unrouted)
SERIAL5_TX  (2 unrouted)
SPI_EXT_MISO  (via drill 0.2)
  Top 0.152: U101.4 30.79,18.86 v30.79,18.9
  Horizontal 0.152: v53.65,32.21 52.93,31.5 43.38,31.5 42.06,32.82 v36.27,32.82
  Vertical 0.152: v36.27,32.82 36.17,32.82 34.24,30.89 34.24,23.16 30.89,19.81 30.89,19 v30.79,18.9
  Bottom 0.152: J403.P$3 55.61,34.17 v53.65,32.21
SPI_EXT_MOSI  (via drill 0.2)
  Top 0.152: U101.5 31.39,18.76 v31.39,19.1
  Horizontal 0.152: v54.56,32.21 53.54,31.19 43.18,31.19 42.06,32.31 v36.68,32.31
  Vertical 0.152: v36.68,32.31 36.37,32.31 34.54,30.48 34.54,22.96 31.39,19.81 v31.39,19.1
  Bottom 0.152: J403.P$4 55.27,32.92 v54.56,32.21
SPI_EXT_SCK  (via drill 0.2)
  Top 0.152: U101.1 29.51,19.71 v29.77,19.71
  Horizontal 0.152: v53.54,32.92 53.14,32.51 43.38,32.51 42.06,33.83 v36.37,33.83
  Vertical 0.152: v36.37,33.83 35.66,33.83 33.63,31.8 33.63,23.57 v29.77,19.71
  Bottom 0.152: J403.P$2 56.04,35.42 v53.54,32.92
SPI_INT_MISO  (via drill 0.2)  (5 unrouted)
  Top 0.152: v42.27,10.87 42.27,10.9 U101.31
  Horizontal 0.152: 63.91,15.54 63.91,12.09 62.38,10.57 43.59,10.57 43.18,10.97 42.37,10.97 v42.27,10.87
  Vertical 0.152: 64.52,7.92 63.91,8.53 63.91,21.23 63.4,21.74
SPI_INT_MOSI  (via drill 0.2)  (5 unrouted)
  Top 0.152: v42.88,10.46 42.88,11 U101.32
  Horizontal 0.152: 64.52,15.85 64.52,12.19 62.34,10.01 54.91,10.01 54.76,10.16 43.18,10.16 v42.88,10.46
  Vertical 0.152: 65.33,7.92 64.52,8.74 64.52,19.91 66.14,21.54
SPI_INT_SCK  (via drill 0.2)  (5 unrouted)
  Top 0.152: U101.30 42.47,9.99 v42.47,9.96
  Horizontal 0.152: 65.23,15.54 65.23,12.3 62.58,9.65 55.98,9.65 55.88,9.55 55.37,9.55 55.27,9.65 42.77,9.65 v42.47,9.96
  Vertical 0.152: 66.45,7.82 65.23,9.04 65.23,19.61 66.65,21.03
VBAT  (1 unrouted)
  Top 0.152: U101.6 29.19,15.85 28.35,15.85
VBUS  (via drill 0.3)
  Top 0.254: U$301.5 43.89,32.51 44.91,32.51 | 44.91,32.51 44.91,30.38 42.77,28.25 42.77,28.02 U101.68 | 44.91,32.51 44.91,33.93 v45.21,34.24 | 57.01,32.11 v58.42,32.11 | v63.2,35.97 63.12,35.9
  Top 0.406: J301.VBUS 44.78,35.28 v45.21,34.85
  Top 0.61: v45.21,34.85 v45.21,34.24
  Horizontal 0.254: v63.2,35.97 65.02,35.97 65.13,35.87
  Horizontal 1.016: v45.21,34.24 45.21,37.59 46.33,38.71 63.7,38.71 65.13,37.29 65.13,35.87 65.13,32.82 66.85,31.09
  Vertical 0.254: v58.42,32.11 59.33,32.11 v63.2,35.97
  Bottom 0.406: J302.P$1 43.44,36.62 v45.21,34.85
  pour Top (no thermals): 66.75,29.26 67.77,29.26 67.77,31.19 66.75,31.19
  pour Horizontal (no thermals): 66.75,29.26 67.77,29.26 67.77,31.19 66.75,31.19
VDD_3V3_SENSORS  (13 unrouted)
  Bottom 0.254: VDDA_3V1101.P$1 62.99,1.32 63.5,1.83
  pour Power: 69.9,0 69.9,22.35 62.18,22.35 62.18,0
VDD_3V3_SENSORS_EN  (via drill 0.2)  (2 unrouted)
  Top 0.152: U101.2 29.46,18.95 v29.46,19
  Horizontal 0.152: v29.46,19 30.38,18.09 44.4,18.09 45.72,16.76 53.54,16.76 56.39,13.92 56.79,13.92
VDD_3V3_SPEKTRUM  (3 unrouted)
VDD_3V3_SPEKTRUM_EN  (1 unrouted)
VDD_5V_BRICK
  pour Top (no thermals): 66.75,36.88 68.17,36.88 68.17,37.8 66.75,37.8
  pour Bottom (no thermals): 63.7,35.15 68.17,35.15 68.17,37.8 63.7,37.8
VDD_5V_HIPOWER
  Top 0.406: L201.P$1 36.78,37.59
VDD_5V_IN  (via drill 0.3)  (7 unrouted)
  Top 0.254: R609.P$2 v50.6,24.18
  Bottom 0.254: U703.A3 U703.A2
  Bottom 0.305: U703.A2 U703.A1
  other vias: 36.37,36.47
  pour Top (no thermals): 67.26,36.47 69.8,36.47 69.8,22.66 62.69,22.66 62.69,25.7 67.26,25.7 67.26,28.85 68.17,28.85 68.17,31.6 67.26,31.6 67.26,32.61 68.17,32.61 68.17,35.36 67.26,35.36
  pour Power (no thermals): 34.75,36.68 63.6,36.68 63.6,35.15 69.9,35.15 69.9,40.44 34.75,40.44
  pour Bottom (no thermals): 50.8,20.83 47.14,20.83 47.14,26.01 50.8,26.01
  pour Bottom (no thermals): 51.31,20.83 51.31,26.01 51.92,26.01 51.92,20.83
  pour Bottom (no thermals): 52.43,20.83 52.43,26.01 56.18,26.01 56.18,20.83
  pour Top (no thermals): 35.66,36.58 35.66,35.36 36.98,35.36 36.98,36.58
VDD_5V_PERIPH  (via drill 0.3)  (3 unrouted)
  Top 0.406: 30.58,7.72 30.73,7.87 L203.P$1 | L404.P$1 v47.14,12.29 | v22.86,34.54 23.18,34.86 L202.P$1 | v53.85,34.14 54.34,34.14 L402.P$1
  Power 0.61: 37.39,6.1 37.39,0.51 | 29.57,0.51 29.57,6.71 30.58,7.72 | v47.14,12.29 47.14,0.51
  pour Power (no thermals): 61.67,0 22.56,36.27 22.56,34.24 43.08,34.24 43.08,31.19 59.13,31.19 59.13,0.81 28.85,0.81 28.85,0
  pour Top (no thermals): 61.77,25.81 61.77,24.89 60.55,24.89 60.55,25.81
VDD_5V_SENS  (via drill 0.2)
  Top 0.152: U101.29 40.03,11.72 v40.03,11.99 | R610.P$1 R609.P$1 v52.22,23.37
  Horizontal 0.152: v39.93,24.28 40.54,24.89 43.99,24.89 45.52,23.37 v52.22,23.37
  Vertical 0.152: v40.03,11.99 39.12,12.9 39.12,23.47 v39.93,24.28
VDD_SERVO  (16 unrouted)
  pour Vertical (no thermals): 69.9,40.54 69.9,32.61 66.34,32.61 62.38,36.58
  pour Top (no thermals): 66.75,33.02 67.77,33.02 67.77,34.95 66.75,34.95
VDD_SERVO_IN  (1 unrouted)
VDD_SERVO_SENS  (1 unrouted)

## Text on the board
tPlace: PX4FMU v2.3
bPlace: FMU PWR | FMU B/E | USB | SER2 | SER1 | Y | POWER | SPI | Z | X | SPKT | SWITCH | BUZZER | ADC | SER4 | PX4FMU 2.3 | (c) 2013 mjs/lm/jo | IO PWR | IO B/E | IO ACT | AIR | SER3 | CAN | I2C
Document: Optimized for good / manual soldering / accessibility